# EAGLE schematic Integrated_final (EAGLE 9.5.2)
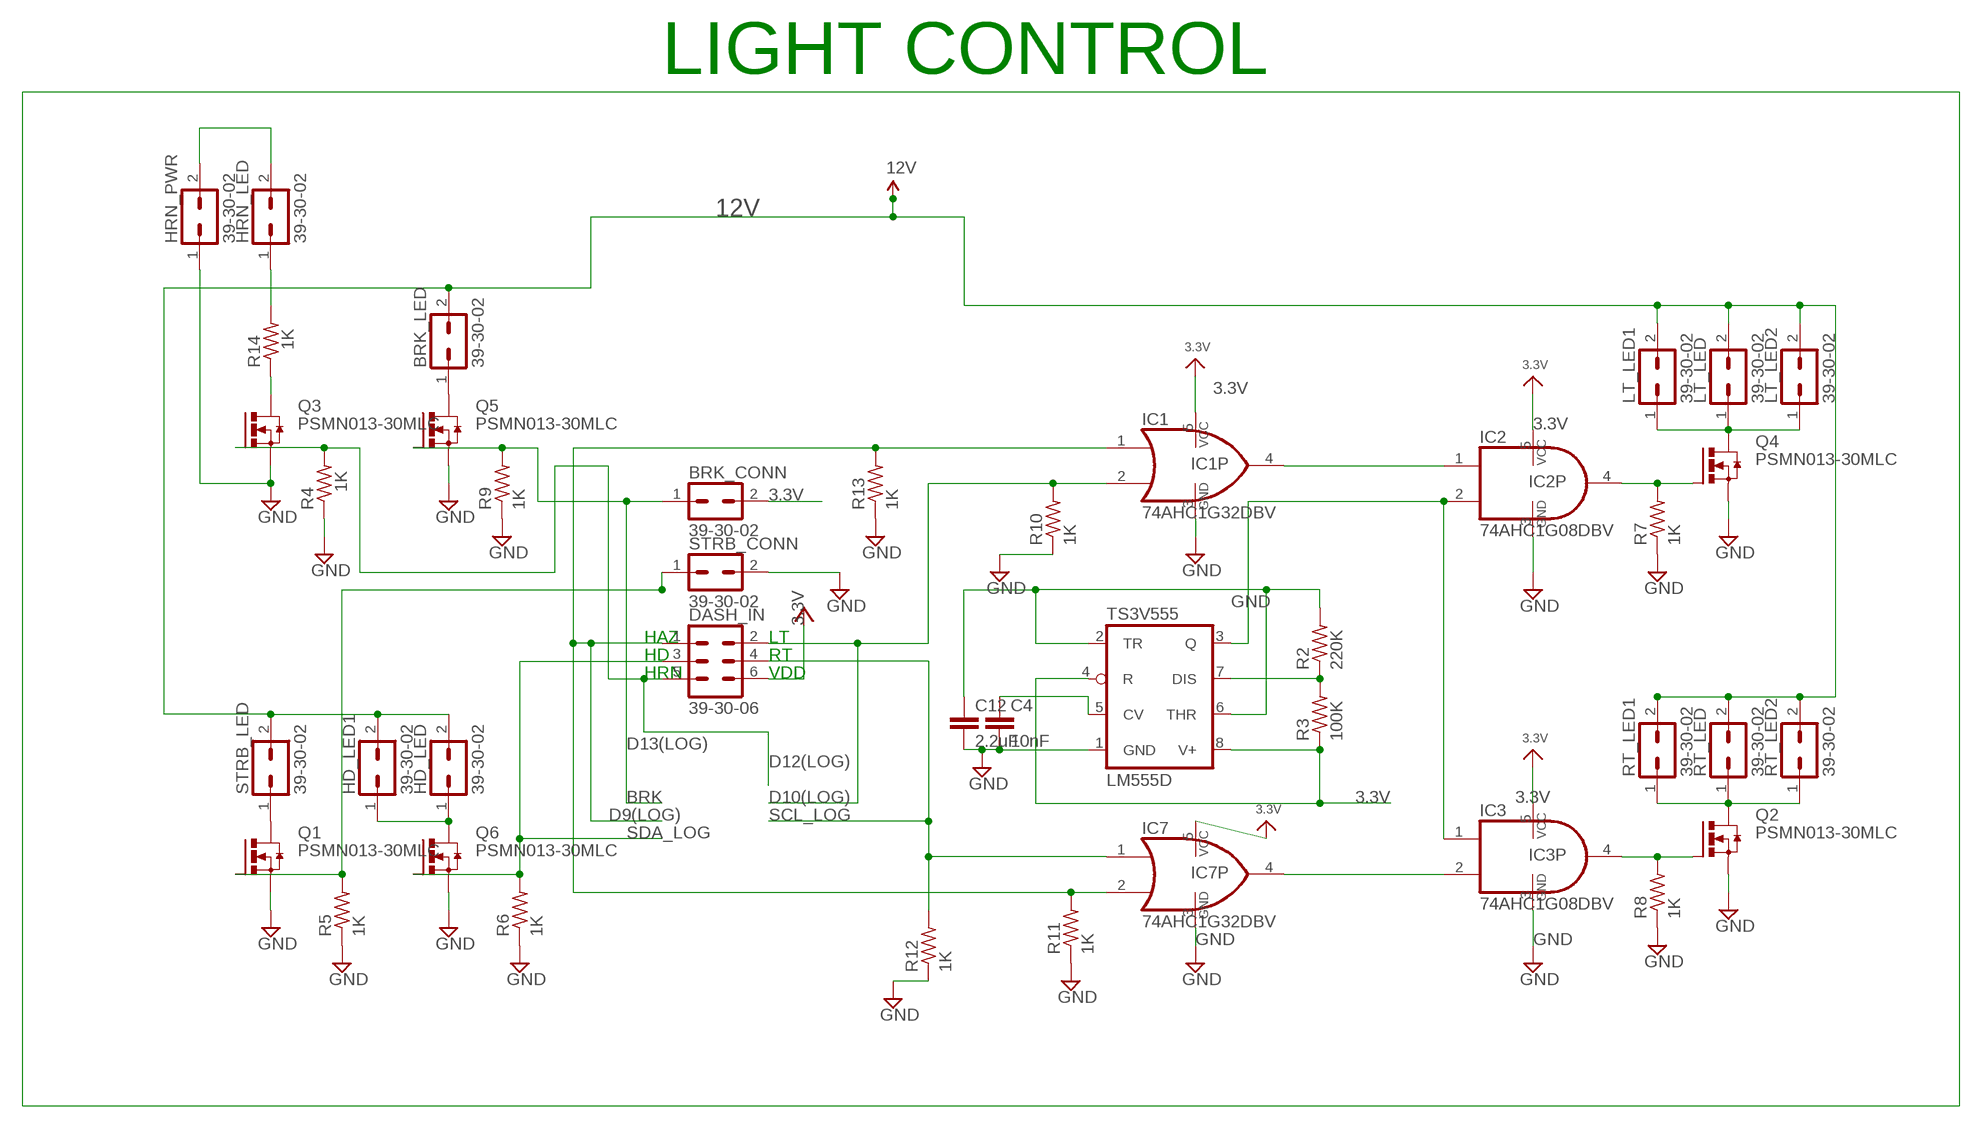
[diagram p0: schematic, sheet 1, part 1 of 2]
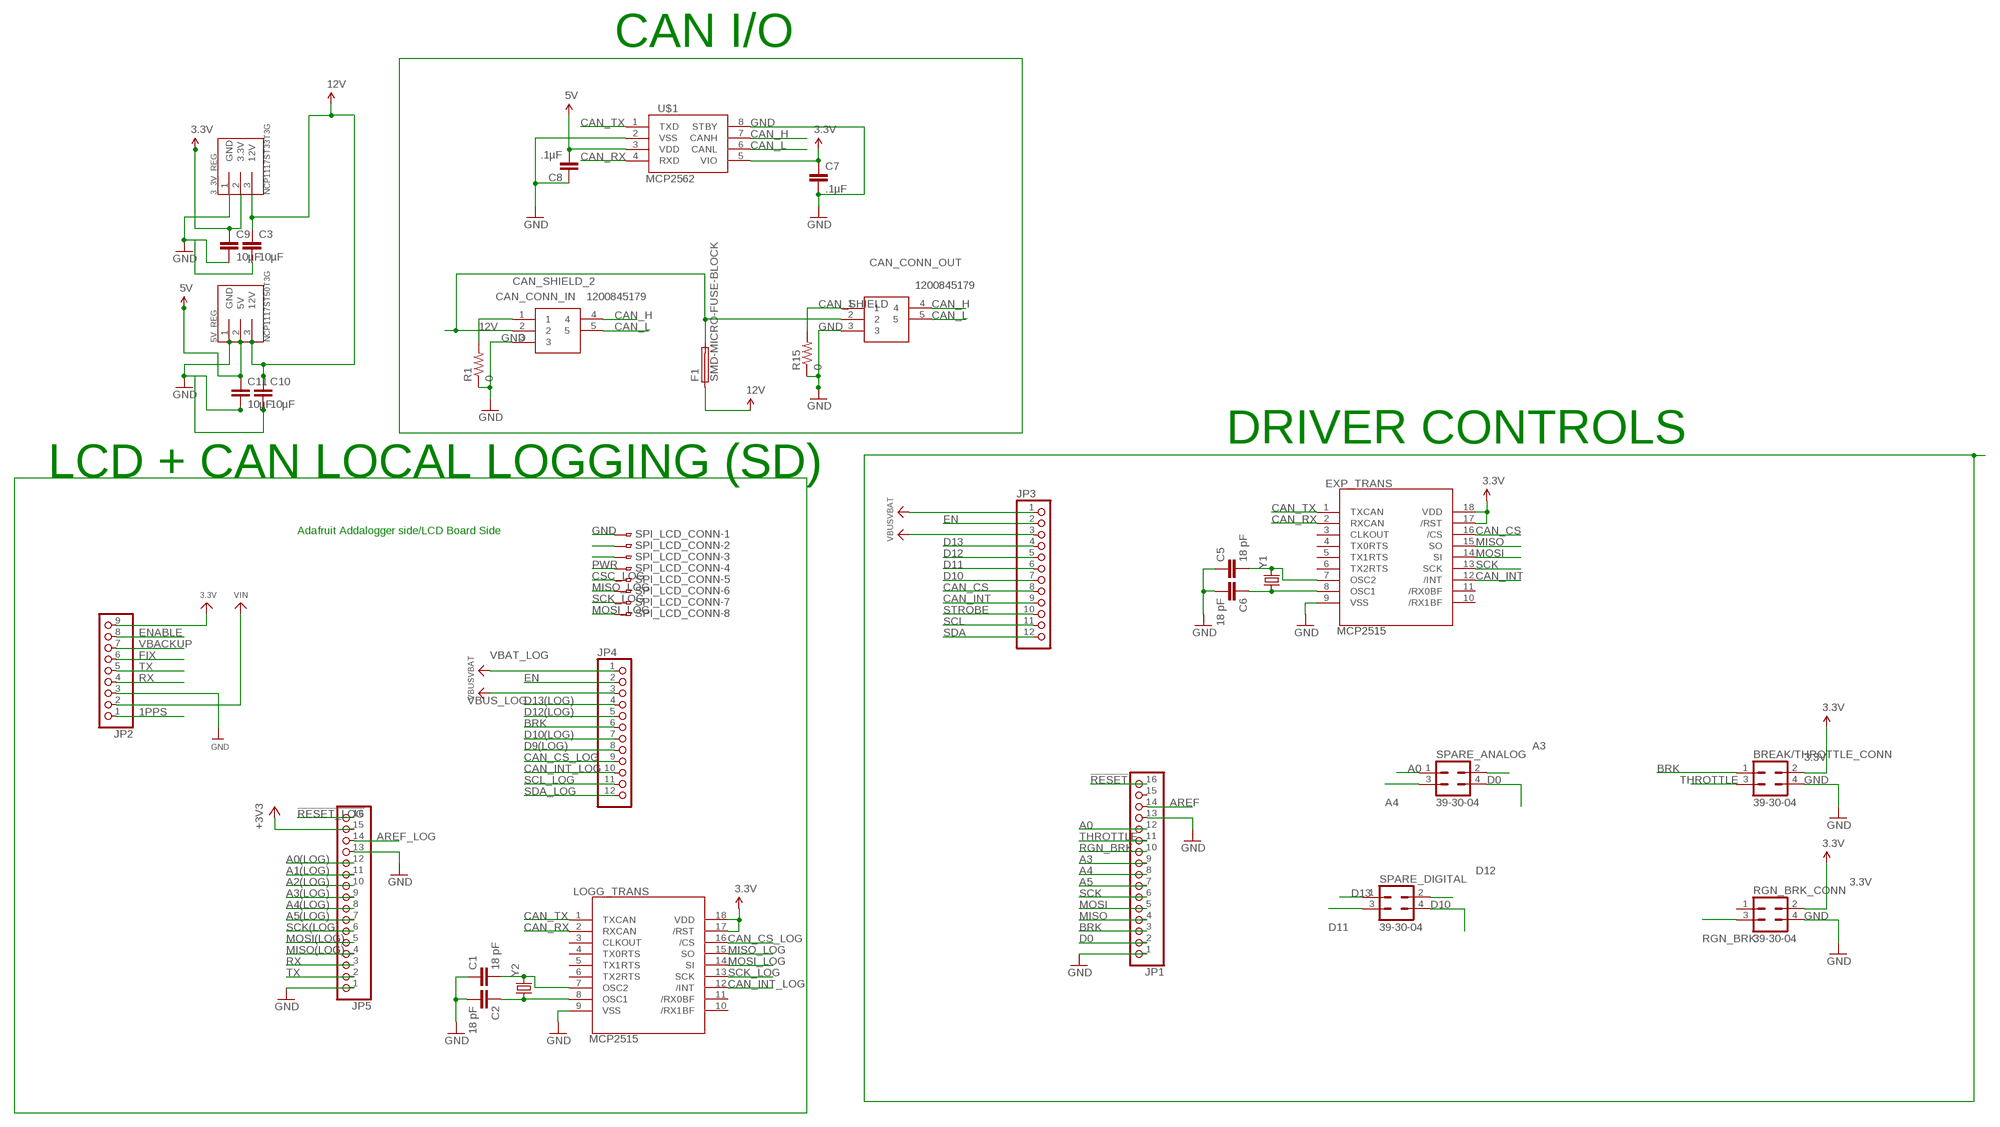
[diagram p1: schematic, sheet 1, part 2 of 2]

## Parts
3_3V_REG  NCP1117ST33T3G  [SOT223]
5V_REG  NCP1117ST50T3G  [SOT223]
BREAK/THROTTLE_CONN  39-30-04  [39-30-?04?]
BRK_CONN  39-30-02  [39-30-?02?]
BRK_LED  39-30-02  [39-30-?02?]
C1  18 pF  CAP0805  [0805]
C2  18 pF  CAP0805  [0805]
C3  10µF  CAP0805  [0805]
C4  10nF  C  [C0805]
C5  18 pF  CAP0805  [0805]
C6  18 pF  CAP0805  [0805]
C7  .1µF  CAP0805  [0805]
C8  .1µF  CAP0805  [0805]
C9  10µF  CAP0805  [0805]
C10  10µF  CAP0805  [0805]
C11  10µF  CAP0805  [0805]
C12  2.2uF  C  [C0805]
CAN_CONN_IN  1200845179  [1200845179]
CAN_CONN_OUT  1200845179  [1200845179]
DASH_IN  39-30-06  [39-30-?06?]
EXP_TRANS  MCP2515  [SO-18W]
F1  SMD-MICRO-FUSE-BLOCK  [OMNIBLOK]
HD_LED  39-30-02  [39-30-?02?]
HD_LED1  39-30-02  [39-30-?02?]
HRN_LED  39-30-02  [39-30-?02?]
HRN_PWR  39-30-02  [39-30-?02?]
IC1  74AHC1G32DBV  [SOT23-5]
IC2  74AHC1G08DBV  [SOT23-5]
IC3  74AHC1G08DBV  [SOT23-5]
IC7  74AHC1G32DBV  [SOT23-5]
JP1  HEADER-1X16ROUND  [1X16_ROUND]
JP2  HEADER-1X970MIL  [1X09_ROUND_70]
JP3  HEADER-1X12  [1X12_ROUND]
JP4  HEADER-1X12  [1X12_ROUND]
JP5  HEADER-1X16ROUND  [1X16_ROUND]
LOGG_TRANS  MCP2515  [SO-18W]
LT_LED  39-30-02  [39-30-?02?]
LT_LED1  39-30-02  [39-30-?02?]
LT_LED2  39-30-02  [39-30-?02?]
Q1  PSMN013-30MLC  [LFPAK33]
Q2  PSMN013-30MLC  [LFPAK33]
Q3  PSMN013-30MLC  [LFPAK33]
Q4  PSMN013-30MLC  [LFPAK33]
Q5  PSMN013-30MLC  [LFPAK33]
Q6  PSMN013-30MLC  [LFPAK33]
R1  0  R-US_R0805  [R0805]
R2  220K  R-US_R0805  [R0805]
R3  100K  R-US_R0805  [R0805]
R4  1K  R-US_R0805  [R0805]
R5  1K  R-US_R0805  [R0805]
R6  1K  R-US_R0805  [R0805]
R7  1K  R-US_R0805  [R0805]
R8  1K  R-US_R0805  [R0805]
R9  1K  R-US_R0805  [R0805]
R10  1K  R-US_R0805  [R0805]
R11  1K  R-US_R0805  [R0805]
R12  1K  R-US_R0805  [R0805]
R13  1K  R-US_R0805  [R0805]
R14  1K  R-US_R0805  [R0805]
R15  0  R-US_R0805  [R0805]
RGN_BRK_CONN  39-30-04  [39-30-?04?]
RT_LED  39-30-02  [39-30-?02?]
RT_LED1  39-30-02  [39-30-?02?]
RT_LED2  39-30-02  [39-30-?02?]
SPARE_ANALOG  39-30-04  [39-30-?04?]
SPARE_DIGITAL  39-30-04  [39-30-?04?]
SPI_LCD_CONN  FH12-08S-1SH  [FH12-08S-1SH]
STRB_CONN  39-30-02  [39-30-?02?]
STRB_LED  39-30-02  [39-30-?02?]
TS3V555  LM555D  [SO08]
U$1  MCP2562  [SOIC8]
Y1  CRYSTALHC49US  [HC49US]
Y2  CRYSTALHC49US  [HC49US]

## Nets
1PPS: JP2.1
3.3V: 3_3V_REG.2(3.3V) BREAK/THROTTLE_CONN.2 BRK_CONN.2 C7.1 C9.1 DASH_IN.6 EXP_TRANS.17(/RST) EXP_TRANS.18(VDD) IC1.5(VCC) IC2.5(VCC) IC3.5(VCC) IC7.5(VCC) JP2.9 JP5.15 LOGG_TRANS.17(/RST) LOGG_TRANS.18(VDD) R3.1 RGN_BRK_CONN.2 TS3V555.4(R) TS3V555.8(V+) U$1.5(VIO) ; supply symbol labelled VCC, +3V3
5V: 5V_REG.2(5V) C8.2 C11.1 U$1.3(VDD)
12V: 3_3V_REG.3(12V) 5V_REG.3(12V) BRK_LED.2 C3.1 C10.1 CAN_CONN_IN.2 CAN_CONN_OUT.2 F1.P$1 F1.P$2 HD_LED1.2 HD_LED.2 LT_LED1.2 LT_LED2.2 LT_LED.2 RT_LED1.2 RT_LED2.2 RT_LED.2 STRB_LED.2
!RESET: JP1.16
!RESET_LOG: JP5.16
A0: JP1.12 SPARE_ANALOG.1
A0(LOG): JP5.12
A1(LOG): JP5.11
A2(LOG): JP5.10
A3: JP1.9 SPARE_ANALOG.2
A3(LOG): JP5.9
A4: JP1.8 SPARE_ANALOG.3
A4(LOG): JP5.8
A5: JP1.7
A5(LOG): JP5.7
AREF: JP1.14
AREF_LOG: JP5.14
BRK: BREAK/THROTTLE_CONN.1 BRK_CONN.1 JP1.3 JP4.6 Q5.4(G) R9.2
CAN_CS: EXP_TRANS.16(/CS) JP3.8
CAN_CS_LOG: JP4.9 LOGG_TRANS.16(/CS)
CAN_H: CAN_CONN_IN.4 CAN_CONN_OUT.4 U$1.7(CANH)
CAN_INT: EXP_TRANS.12(/INT) JP3.9
CAN_INT_LOG: JP4.10 LOGG_TRANS.12(/INT)
CAN_L: CAN_CONN_IN.5 CAN_CONN_OUT.5 U$1.6(CANL)
CAN_RX: EXP_TRANS.2(RXCAN) LOGG_TRANS.2(RXCAN) U$1.4(RXD)
CAN_SHIELD: CAN_CONN_OUT.1 R15.2
CAN_SHIELD_2: CAN_CONN_IN.1 R1.2
CAN_TX: EXP_TRANS.1(TXCAN) LOGG_TRANS.1(TXCAN) U$1.1(TXD)
CSC_LOG: SPI_LCD_CONN.5
D0: JP1.2 SPARE_ANALOG.4
D9(LOG): DASH_IN.1 IC1.1(I0) IC7.2(I1) JP4.8 R11.2 R13.2
D10: JP3.7 SPARE_DIGITAL.4
D10(LOG): DASH_IN.2 IC1.2(I1) JP4.7 R10.2
D11: JP3.6 SPARE_DIGITAL.3
D12: JP3.5 SPARE_DIGITAL.2
D12(LOG): DASH_IN.5 JP4.5 Q3.4(G) R4.2
D13: JP3.4 SPARE_DIGITAL.1
D13(LOG): JP4.4 Q1.4(G) R5.2 STRB_CONN.1
EN: JP3.2 JP4.2
ENABLE: JP2.8
FIX: JP2.6
GND: 3_3V_REG.1(GND) 5V_REG.1(GND) BREAK/THROTTLE_CONN.4 C1.1 C2.2 C3.2 C4.2 C5.1 C6.2 C7.2 C8.1 C9.2 C10.2 C11.2 C12.2 CAN_CONN_IN.3 CAN_CONN_OUT.3 EXP_TRANS.9(VSS) HRN_PWR.1 IC1.3(GND) IC2.3(GND) IC3.3(GND) IC7.3(GND) JP1.1 JP1.13 JP2.3 JP5.1 JP5.13 LOGG_TRANS.9(VSS) Q1.1(S) Q1.2(S) Q1.3(S) Q2.1(S) Q2.2(S) Q2.3(S) Q3.1(S) Q3.2(S) Q3.3(S) Q4.1(S) Q4.2(S) Q4.3(S) Q5.1(S) Q5.2(S) Q5.3(S) Q6.1(S) Q6.2(S) Q6.3(S) R1.1 R4.1 R5.1 R6.1 R7.1 R8.1 R9.1 R10.1 R11.1 R12.1 R13.1 R15.1 RGN_BRK_CONN.4 SPI_LCD_CONN.1 STRB_CONN.2 TS3V555.1(GND) U$1.2(VSS) U$1.8(STBY)
MISO: EXP_TRANS.15(SO) JP1.4
MISO(LOG): JP5.4
MISO_LOG: LOGG_TRANS.15(SO) SPI_LCD_CONN.6
MOSI: EXP_TRANS.14(SI) JP1.5
MOSI(LOG): JP5.5
MOSI_LOG: LOGG_TRANS.14(SI) SPI_LCD_CONN.8
N$1: C5.2 EXP_TRANS.7(OSC2) Y1.2
N$3: C2.1 LOGG_TRANS.8(OSC1) Y2.1
N$4: SPI_LCD_CONN.2
N$5: SPI_LCD_CONN.3
N$6: C1.2 LOGG_TRANS.7(OSC2) Y2.2
N$8: R2.1 R3.2 TS3V555.7(DIS)
N$9: C12.1 R2.2 TS3V555.2(TR) TS3V555.6(THR)
N$10: IC2.2(I1) IC3.1(I0) TS3V555.3(Q)
N$11: C6.1 EXP_TRANS.8(OSC1) Y1.1
N$15: IC2.4(O) Q4.4(G) R7.2
N$16: IC3.4(O) Q2.4(G) R8.2
N$17: LT_LED1.1 LT_LED2.1 LT_LED.1 Q4.MB(D)
N$18: Q2.MB(D) RT_LED1.1 RT_LED2.1 RT_LED.1
N$19: HD_LED1.1 HD_LED.1 Q6.MB(D)
N$24: Q1.MB(D) STRB_LED.1
N$25: BRK_LED.1 Q5.MB(D)
N$28: IC1.4(O) IC2.1(I0)
N$29: IC3.2(I1) IC7.4(O)
N$31: HRN_LED.2 HRN_PWR.2
N$32: HRN_LED.1 R14.2
N$33: Q3.MB(D) R14.1
PWR: SPI_LCD_CONN.4
RGN_BRK: JP1.10 RGN_BRK_CONN.3
RX: JP2.4 JP5.3
SCK: EXP_TRANS.13(SCK) JP1.6
SCK(LOG): JP5.6
SCK_LOG: LOGG_TRANS.13(SCK) SPI_LCD_CONN.7
SCL: JP3.11
SCL_LOG: DASH_IN.4 IC7.1(I0) JP4.11 R12.2
SDA: JP3.12
SDA_LOG: DASH_IN.3 JP4.12 Q6.4(G) R6.2
STROBE: JP3.10
THROTTLE: BREAK/THROTTLE_CONN.3 JP1.11
TS3V555: C4.1 TS3V555.5(CV)
TX: JP2.5 JP5.2
VBACKUP: JP2.7
VBAT: JP3.1
VBAT_LOG: JP4.1 ; supply symbol labelled VBAT
VBUS: JP3.3
VBUS_LOG: JP4.3 ; supply symbol labelled VBUS
VIN: JP2.2
Unconnected: EXP_TRANS.3(CLKOUT) EXP_TRANS.4(TX0RTS) EXP_TRANS.5(TX1RTS) EXP_TRANS.6(TX2RTS) EXP_TRANS.10(/RX1BF) EXP_TRANS.11(/RX0BF) JP1.15 LOGG_TRANS.3(CLKOUT) LOGG_TRANS.4(TX0RTS) LOGG_TRANS.5(TX1RTS) LOGG_TRANS.6(TX2RTS) LOGG_TRANS.10(/RX1BF) LOGG_TRANS.11(/RX0BF) RGN_BRK_CONN.1

## Notes on the sheet
- CAN I/O
- DRIVER CONTROLS
- LIGHT CONTROL | LCD + CAN LOCAL LOGGING (SD)
- Adafruit Addalogger side/LCD Board Side
- HAZ | LT
- HD | RT
- HRN | VDD

## Library data of the parts
3_3V_REG = NUSOLAR_Custom:NCP1117ST33T3G
5V_REG = NUSOLAR_Custom:NCP1117ST50T3G
BREAK/THROTTLE_CONN RGN_BRK_CONN SPARE_ANALOG SPARE_DIGITAL = con-molex-mini-fit:39-30-?04?: HEADER
BRK_CONN BRK_LED HD_LED HD_LED1 HRN_LED HRN_PWR LT_LED LT_LED1 LT_LED2 RT_LED RT_LED1 RT_LED2 STRB_CONN STRB_LED = con-molex-mini-fit:39-30-?02?: HEADER
C1-C3 C5-C11 = SparkFun-Capacitors:CAP: Capacitor Standard 0603 ceramic capacitor, and 0.1" leaded capacitor.
C4 C12 = eagle-ltspice:C: CAPACITOR, European symbol; SPICEMODEL: NONE; SPICEPREFIX: C
CAN_CONN_IN CAN_CONN_OUT = SamacSys_Parts:1200845179: REC U12 5P AC FE M16 BM SOL SHD Source: Datasheet <https://componentsearchengine.com/Datasheets/1/1200845179.pdf>; DESCRIPTION: REC U12 5P AC FE M16 BM SOL SHD; HEIGHT: 24.8mm; MANUFACTURER_NAME: Molex; MANUFACTURER_PART_NUMBER: 1200845179; MOUSER_PART_NUMBER: 538-1200845179; MOUSER_PRICE-STOCK: https://www.mouser.com/Search/Refine.aspx?Keyword=538-1200845179
DASH_IN = con-molex-mini-fit:39-30-?06?: HEADER
EXP_TRANS LOGG_TRANS = NUSOLAR_Custom:MCP2515
F1 = f-lf-omniblok-s:SMD-MICRO-FUSE
IC1 IC7 = 74xx-little-us:74*1G32: 2-input OR gate
IC2 IC3 = 74xx-little-us:74*1G08: 2-input AND gate
JP1 JP5 = microbuilder:HEADER-1X16: PIN HEADER
JP2 = microbuilder:HEADER-1X9: PIN HEADER
JP3 JP4 = microbuilder:HEADER-1X12
Q1-Q6 = transistor-power:PSMN013-30MLC: N-channel 30 V 13.6 mΩ logic level MOSFET NextPower Technology Source: Data sheet <http://www.nxp.com/documents/data_sheet/PSMN013-30MLC.pdf> PSMN013-30MLC © NXP B.V. 2012. All rights reserved.; MPN: PSMN013-30MLC; OC_FARNELL: 2115260; OC_NEWARK: 05W5709
R1-R15 = rcl:R-US_: RESISTOR, American symbol
SPI_LCD_CONN = con-hirose:FH12-08S-1S: 1mm Pitch Connectors For FPC/FFC Source: Data sheet <http://www.hirose.co.jp/cataloge_hp/e58605370.pdf>; OC_FARNELL: unknown; OC_NEWARK: unknown
TS3V555 = linear:*555: TIMER
U$1 = NUSOLAR_Custom:MCP2562
Y1 Y2 = SparkFun-FreqCtrl:CRYSTAL: Various standard crystals. Proven footprints.